# Altium project SMPS_12V&5V Out.PrjPCB
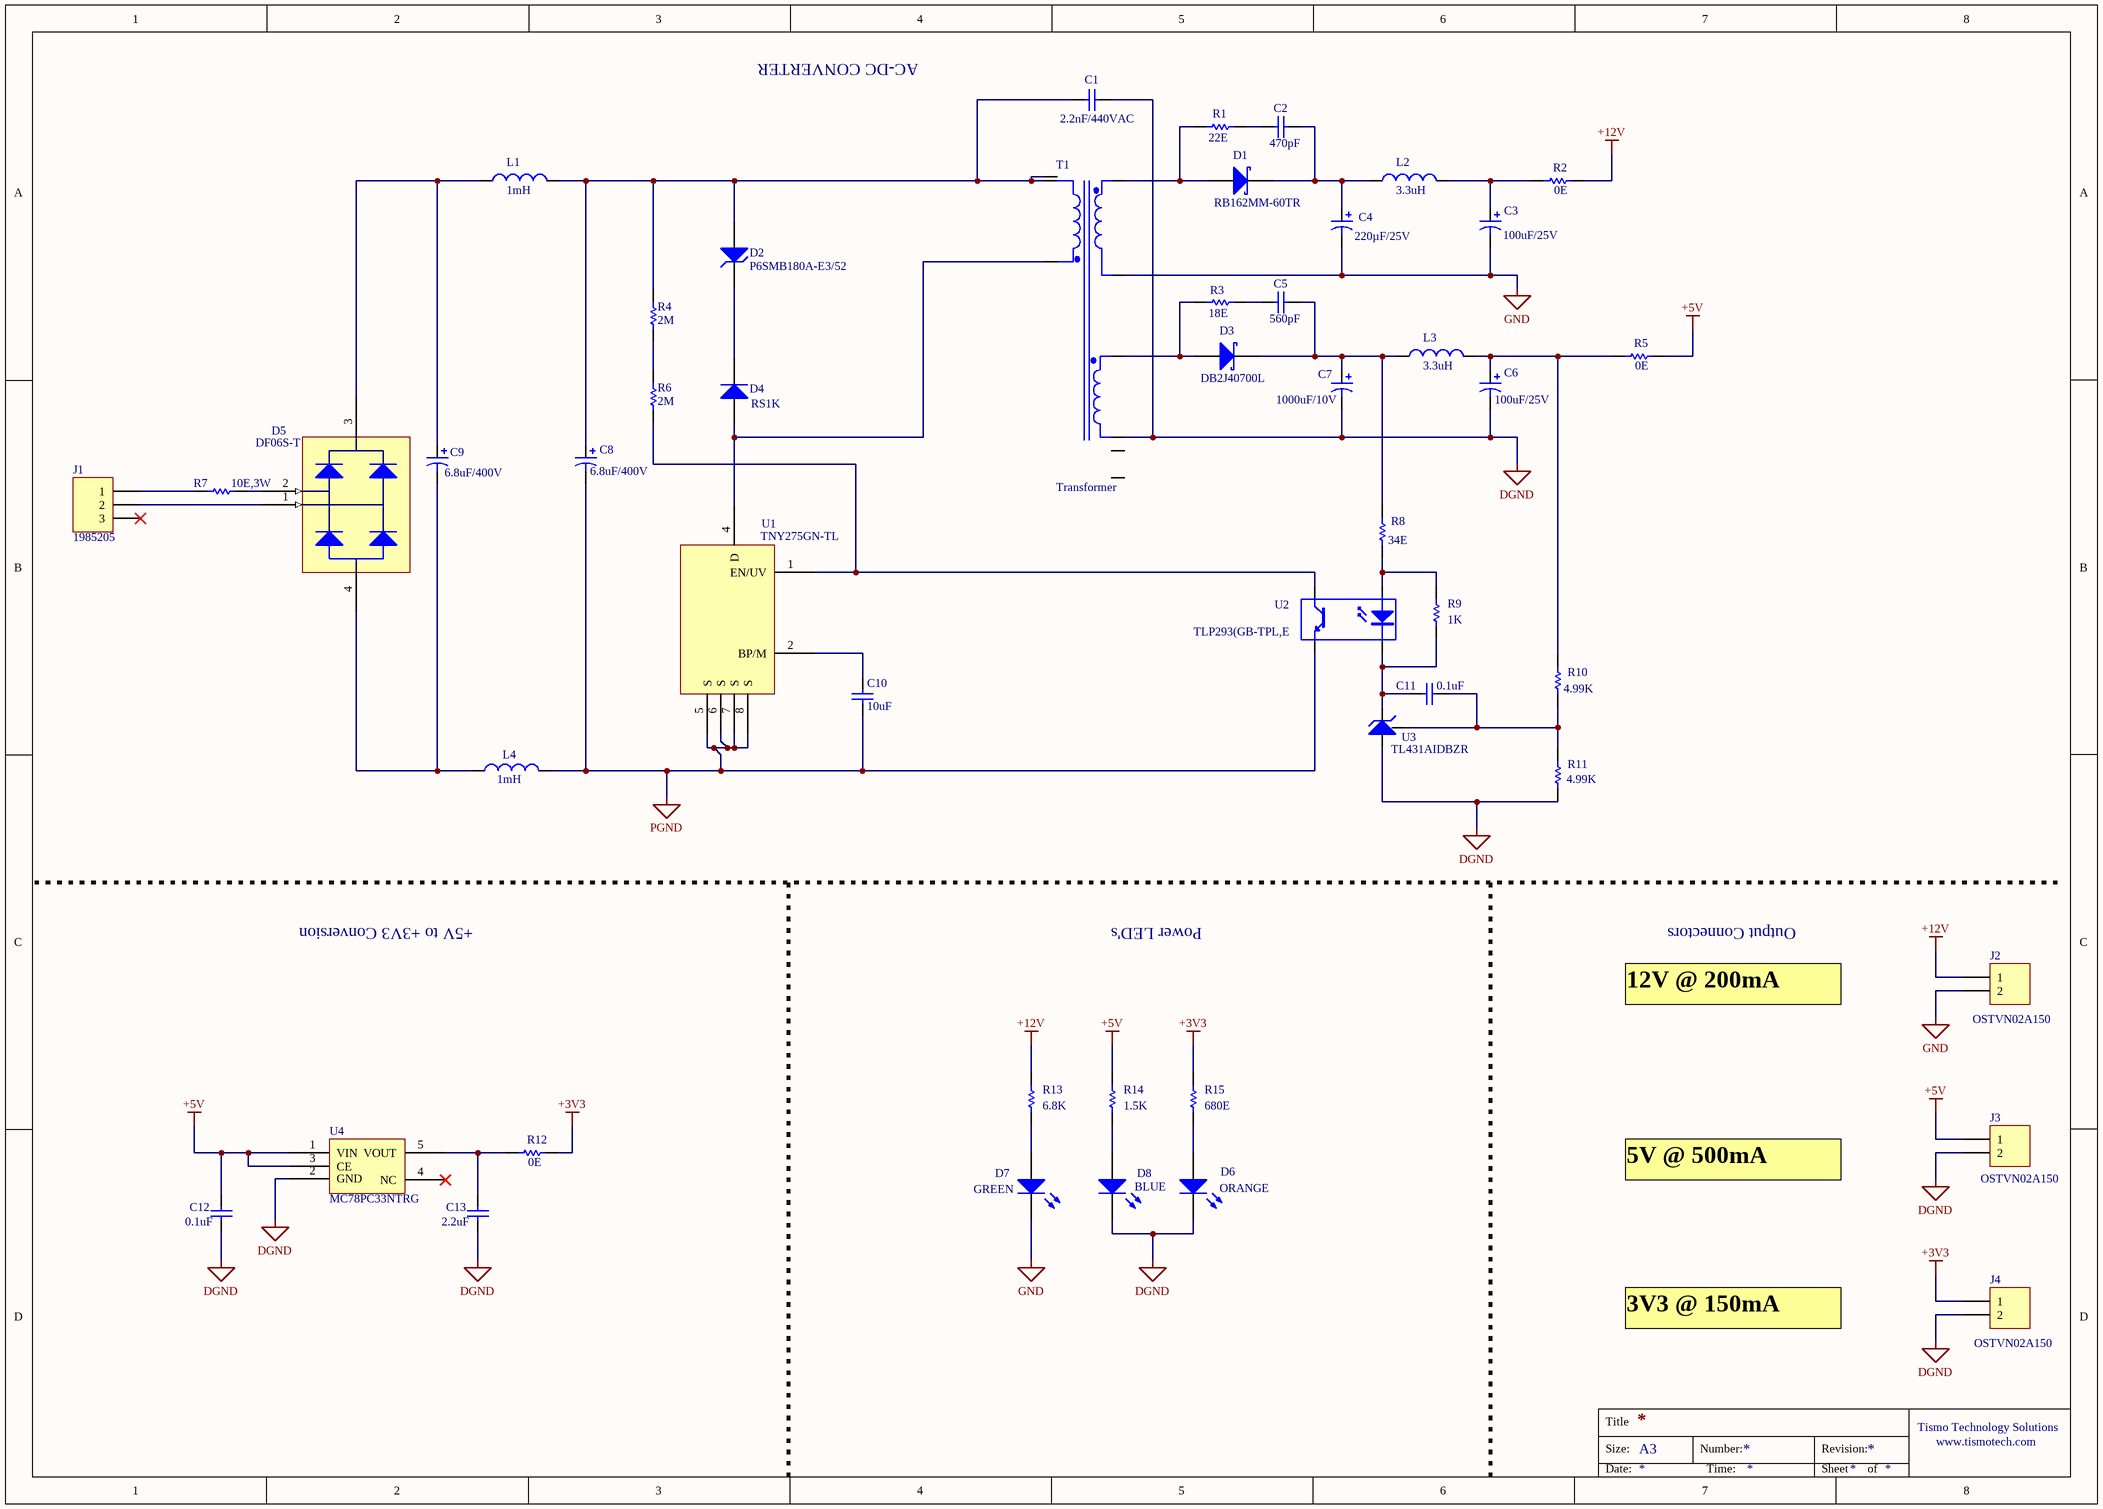
[diagram p0: SMPS.SchDoc]
1 sheet, 49 parts. Net scope: global (net labels, ports and power ports of the same name join across sheets).
Board file: SMPS.PcbDoc

## Sheet SMPS.SchDoc
size A3

### Parts
C1  2.2nF/440VAC  [2.2nF CAP]
C2  470pF  [C0603]
C3  100uF/25V  [CAP 6.3MM DIA]
C4  220µF/25V  [CAP 8 MM DIA]
C5  560pF  [C0603]
C6  100uF/25V  [CAP 6.3MM DIA]
C7  1000uF/10V  [CAP 10MM DIA]
C8  6.8uF/400V  [CAP 8 MM DIA]
C9  6.8uF/400V  [CAP 8 MM DIA]
C10  10uF  [R0805_2012]
C11  0.1uF  [R0805_2012]
C12  0.1uF  [R0805_2012]
C13  2.2uF  [R0805_2012]
D1  RB162MM-60TR  [GS-1_A]
D2  P6SMB180A-E3/52  [P6SMB]
D3  DB2J40700L  [SOD323]
D4  RS1K  [SMA]
D5  DF06S-T  [DF06S]
D6  ORANGE  [1.6X0.8X0.8]
D7  GREEN  [1.6X0.8X0.8]
D8  BLUE  [1.6X0.8X0.8]
J1  1985205  [AC SUPPLY CONNECTOR]
J2  OSTVN02A150  [OSTVN02A150]
J3  OSTVN02A150  [OSTVN02A150]
J4  OSTVN02A150  [OSTVN02A150]
L1  1mH  [SDR0805-102KL]
L2  3.3uH  [SDE0604A-120M]
L3  3.3uH  [SDE0604A-120M]
L4  1mH  [SDR0805-102KL]
R1  22E  [1206]
R2  0E  [R0603]
R3  18E  [1206]
R4  2M  [R1206 - Small pad]
R5  0E  [R0603]
R6  2M  [R1206 - Small pad]
R7  10E,3W  [FUSIBLE RESISTOR]
R8  34E  [R0603]
R9  1K  [R0603]
R10  4.99K  [R0603]
R11  4.99K  [R0603]
R12  0E  [R0603]
R13  6.8K  [R0603]
R14  1.5K  [R0603]
R15  680E  [R0603]
T1  Transformer  [Tra]
U1  TNY275GN-TL  [TNY284DG]
U2  TLP293(GB-TPL,E  [P25S01L]
U3  TL431AIDBZR  [SOT-23_M]
U4  MC78PC33NTRG  [SOT23-5_N]

### Nets
+3V3: J4.1 R12.2 R15.2
+5V: C12.1 J3.1 R5.2 R14.2 U4.1(VIN) U4.3(CE)
+12V: J2.1 R2.2 R13.2
DGND: C1.2 C6.2 C7.2 C12.2 C13.2 D6.2(K) D8.2(K) J3.2 J4.2 R11.1 T1.6 U3.3(A) U4.2(GND)
GND: C3.2 C4.2 D7.2(K) J2.2 T1.9
PGND: C8.2 C10.2 L4.2 U1.5(S) U1.6(S) U1.7(S) U1.8(S) U2.3(E)
NetC1_1: C1.1 C8.1 D2.1(A) L1.2 R4.2 T1.1 T1.2
NetC2_1: C2.1 R1.2
NetC2_2: C2.2 C4.1 D1.K L2.1
NetC3_1: C3.1 L2.2 R2.1
NetC5_1: C5.1 R3.2
NetC5_2: C5.2 C7.1 D3.K L3.1 R8.2
NetC6_1: C6.1 L3.2 R5.1 R10.2
NetC9_1: C9.1 D5.3 L1.1
NetC9_2: C9.2 D5.4 L4.1
NetC10_1: C10.1 U1.2(BP/M)
NetC11_1: C11.1 R10.1 R11.2 U3.1
NetC11_2: C11.2 R9.1 U2.2(K) U3.2(K)
NetC13_1: C13.1 R12.1 U4.5(VOUT)
NetD1_A: D1.A R1.1 T1.10
NetD2_2: D2.2(K) D4.2(K)
NetD3_A: D3.A R3.1 T1.7
NetD4_1: D4.1(A) T1.4 U1.4(D)
NetD5_1: D5.1 J1.2
NetD5_2: D5.2 R7.2
NetD6_1: D6.1(A) R15.1
NetD7_1: D7.1(A) R13.1
NetD8_1: D8.1(A) R14.1
NetJ1_1: J1.1 R7.1
NetR4_1: R4.1 R6.2
NetR6_1: R6.1 U1.1(EN/UV) U2.4(C)
NetR8_1: R8.1 R9.2 U2.1(A)

Not connected (* = marked no-connect by the designer): J1 3*; T1 3 5; U4 4(NC)*

### Notes on the sheet
- AC-DC CONVERTER
- +5V to +3V3 Conversion
- Power LED's
- Output Connectors
- 12V @ 200mA
- 5V @ 500mA
- 3V3 @ 150mA
- Title
- Size:
- A3
- Number:
- Revision:
- Tismo Technology Solutions
- www.tismotech.com
- Date:
- Time:
- Sheet
- of

### Library data of the parts
C1 = Cap: CAP CER 2200PF 440VAC Y5U RADIAL; Manufacturer: Vishay BC Components; Manufacturer Part Number: VY2222M35Y5US63V0; Tolerance: ±20%; Temperature Coefficient: Y5U (E); Ratings: X1, Y2; Supplier 1: Digi-Key; Supplier Part Number 1: BC2704-ND; RoHS: RoHS Compliant; Category: Capacitors; Stock 1: 19465; Pricing 1: 1=0.35, 10=0.24, 100=0.1358, 500=0.09584, 1000=0.08385, 2500=0.07986, 5000=0.07387 (USD); Packaging: Bulk; Part Status: Active; Voltage - Rated: 440VAC; Operating Temperature: -40°C ~ 125°C; Features: -; Applications: Safety; Failure Rate: -; Mounting Type: Through Hole; Package / Case: Radial, Disc; Size / Dimension: 0.354" Dia (9.00mm); Height - Seated (Max): 0.512" (13.00mm); Thickness (Max): -; Lead Spacing: 0.394" (10.00mm); Lead Style: Formed Leads - Kinked; ComponentLink1URL: http://www.vishay.com/docs/28535/vy2series.pdf; ComponentLink1Description: http://www.vishay.com/docs/28535/vy2series.pdf
C2 = Cap: CAP CER 470PF 100V C0G/NP0 0603; Manufacturer: Murata Electronics North America; Manufacturer Part Number: GCM1885C2A471JA16D; Tolerance: ±5%; Temperature Coefficient: C0G, NP0; Supplier 1: Digi-Key; Supplier Part Number 1: 490-4949-1-ND; RoHS: RoHS Compliant; Category: Capacitors; Stock 1: 40036; Pricing 1: 1=0.1, 10=0.076, 100=0.0341, 500=0.02434, 1000=0.01912 (USD); Packaging: Cut Tape (CT); Part Status: Active; Voltage - Rated: 100V; Operating Temperature: -55°C ~ 125°C; Features: -; Ratings: AEC-Q200; Applications: Automotive; Mounting Type: Surface Mount, MLCC; Package / Case: 0603 (1608 Metric); Size / Dimension: 0.063" L x 0.032" W (1.60mm x 0.80mm); Height - Seated (Max): -; Thickness (Max): 0.035" (0.90mm); Lead Spacing: -; Lead Style: -; ComponentLink1URL: http://www.murata.com/~/media/webrenewal/support/library/catalog/products/capacitor/mlcc/c03e.ashx; ComponentLink1Description: http://www.murata.com/~/media/webrenewal/support/library/catalog/products/capacitor/mlcc/c03e.ashx
C3 C6 = Cap Pol2: CAP ALUM 100UF 20% 25V RADIAL; Manufacturer: United Chemi-Con; Manufacturer Part Number: ELXZ250ELL101MFB5D; Capacitance: 100µF; Lifetime @ Temp.: 2000 Hrs @ 105°C; Polarization: Polar; Ripple Current: 116mA @ 120Hz; Impedance: 250 mOhm; Supplier 1: Digi-Key; Supplier Part Number 1: 565-1952-ND; RoHS: RoHS Compliant; Category: Capacitors; Stock 1: 4660; Pricing 1: 1=0.34, 10=0.235, 25=0.1928, 50=0.1646, 100=0.141, 250=0.11752, 500=0.10576, 1000=0.0893, 5000=0.0799 (USD); Packaging: Bulk; Part Status: Active; Tolerance: ±20%; Voltage Rating: 25V; ESR (Equivalent Series Resistance): -; Operating Temperature: -55°C ~ 105°C; Applications: Automotive; Lead Spacing: 0.098" (2.50mm); Size / Dimension: 0.248" Dia (6.30mm); Height - Seated (Max): 0.512" (13.00mm); Surface Mount Land Size: -; Mounting Type: Through Hole; Package / Case: Radial, Can; ComponentLink1URL: http://www.chemi-con.co.jp/cgi-bin/CAT_DB/SEARCH/cat_db_al.cgi?e=e&j=p&pdfname=lxz; ComponentLink1Description: http://www.chemi-con.co.jp/cgi-bin/CAT_DB/SEARCH/cat_db_al.cgi?e=e&j=p&pdfname=lxz
C4 = Cap Pol2: CAP ALUM 220UF 20% 25V RADIAL; Manufacturer: United Chemi-Con; Manufacturer Part Number: EKZE250ELL221MHB5D; Capacitance: 220µF; Lifetime @ Temp.: 3000 Hrs @ 105°C; Polarization: Polar; Ripple Current: 380mA @ 120Hz; Impedance: 72 mOhm; Supplier 1: Digi-Key; Supplier Part Number 1: 565-1674-ND; RoHS: RoHS Compliant; Category: Capacitors; Stock 1: 22214; Pricing 1: 1=0.44, 10=0.312, 25=0.266, 50=0.2356, 100=0.2052, 250=0.1748, 500=0.152, 1000=0.1292, 5000=0.114 (USD); Packaging: Bulk; Part Status: Active; Tolerance: ±20%; Voltage Rating: 25V; ESR (Equivalent Series Resistance): -; Operating Temperature: -40°C ~ 105°C; Applications: General Purpose; Lead Spacing: 0.138" (3.50mm); Size / Dimension: 0.315" Dia (8.00mm); Height - Seated (Max): 0.512" (13.00mm); Surface Mount Land Size: -; Mounting Type: Through Hole; Package / Case: Radial, Can; ComponentLink1URL: http://www.chemi-con.co.jp/cgi-bin/CAT_DB/SEARCH/cat_db_al.cgi?e=e&j=p&pdfname=kze; ComponentLink1Description: http://www.chemi-con.co.jp/cgi-bin/CAT_DB/SEARCH/cat_db_al.cgi?e=e&j=p&pdfname=kze
C5 = Cap: CAP CER 560PF 100V C0G/NP0 0603; Manufacturer: Murata Electronics North America; Manufacturer Part Number: GCM1885C2A561JA16D; Tolerance: ±5%; Temperature Coefficient: C0G, NP0; Supplier 1: Digi-Key; Supplier Part Number 1: 490-14764-1-ND; RoHS: RoHS Compliant; Category: Capacitors; Stock 1: 3690; Pricing 1: 1=0.21, 10=0.145, 100=0.0736, 500=0.05034, 1000=0.04453 (USD); Packaging: Cut Tape (CT); Part Status: Active; Voltage - Rated: 100V; Operating Temperature: -55°C ~ 125°C; Features: -; Ratings: AEC-Q200; Applications: Automotive; Failure Rate: -; Mounting Type: Surface Mount, MLCC; Package / Case: 0603 (1608 Metric); Size / Dimension: 0.063" L x 0.032" W (1.60mm x 0.80mm); Height - Seated (Max): -; Thickness (Max): 0.035" (0.90mm); Lead Spacing: -; Lead Style: -; ComponentLink1URL: http://search.murata.co.jp/Ceramy/image/img/A01X/G101/ENG/GCM1885C2A561JA16-01.pdf; ComponentLink1Description: http://search.murata.co.jp/Ceramy/image/img/A01X/G101/ENG/GCM1885C2A561JA16-01.pdf
C7 = Cap Pol2: CAP ALUM 1000UF 20% 10V RADIAL; Manufacturer: Wurth Electronics Inc.; Manufacturer Part Number: 860020275015; Lifetime @ Temp.: 2000 Hrs @ 105°C; Polarization: Polar; Ripple Current - Low Frequency: 520mA @ 120Hz; Ripple Current - High Frequency: 717.6mA @ 100kHz; Supplier 1: Digi-Key; Supplier Part Number 1: 732-8917-1-ND; RoHS: RoHS Compliant; Category: Capacitors; Stock 1: 1788; Pricing 1: 1=0.35, 50=0.295, 100=0.257, 250=0.228 (USD); Packaging: Cut Tape (CT); Part Status: Active; Tolerance: ±20%; ESR (Equivalent Series Resistance): -; Operating Temperature: -40°C ~ 105°C; Applications: General Purpose; Lead Spacing: 0.197" (5.00mm); Size / Dimension: 0.394" Dia (10.00mm); Height - Seated (Max): 0.551" (14.00mm); Surface Mount Land Size: -; Mounting Type: Through Hole; Package / Case: Radial, Can; ComponentLink1URL: http://katalog.we-online.de/pbs/datasheet/860020275015.pdf; ComponentLink1Description: http://katalog.we-online.de/pbs/datasheet/860020275015.pdf
C8 C9 = Cap Pol2: CAP ALUM 6.8UF 20% 400V RADIAL; Manufacturer: Wurth Electronics Inc.; Manufacturer Part Number: 860021374009; Lifetime @ Temp.: 2000 Hrs @ 105°C; Polarization: Polar; Ripple Current - Low Frequency: 75mA @ 120Hz; Ripple Current - High Frequency: 127.5mA @ 100kHz; Supplier 1: Digi-Key; Supplier Part Number 1: 732-8887-1-ND; RoHS: RoHS Compliant; Category: Capacitors; Stock 1: 800; Pricing 1: 1=0.5, 50=0.427, 100=0.372, 250=0.331 (USD); Packaging: Cut Tape (CT); Part Status: Active; Tolerance: ±20%; ESR (Equivalent Series Resistance): -; Operating Temperature: -25°C ~ 105°C; Applications: General Purpose; Lead Spacing: 0.138" (3.50mm); Size / Dimension: 0.315" Dia (8.00mm); Height - Seated (Max): 0.610" (15.50mm); Surface Mount Land Size: -; Mounting Type: Through Hole; Package / Case: Radial, Can; ComponentLink1URL: http://katalog.we-online.de/pbs/datasheet/860021374009.pdf; ComponentLink1Description: http://katalog.we-online.de/pbs/datasheet/860021374009.pdf
C10 = Cap: CAP CER 10UF 16V X7R 1206; Manufacturer: TDK Corporation; Manufacturer Part Number: C3216X7R1C106K160AC; Tolerance: ±10%; Supplier 1: Digi-Key; Supplier Part Number 1: 445-4042-1-ND; RoHS: RoHS Compliant; Category: Capacitors; Stock 1: 270274; Pricing 1: 1=0.32, 10=0.222, 100=0.126, 500=0.08896, 1000=0.07785 (USD); Packaging: Cut Tape (CT); Part Status: Active; Voltage - Rated: 16V; Temperature Coefficient: X7R; Operating Temperature: -55°C ~ 125°C; Features: Low ESL; Ratings: -; Applications: General Purpose; Failure Rate: -; Mounting Type: Surface Mount, MLCC; Package / Case: 1206 (3216 Metric); Size / Dimension: 0.126" L x 0.063" W (3.20mm x 1.60mm); Height - Seated (Max): -; Thickness (Max): 0.071" (1.80mm); Lead Spacing: -; Lead Style: -; ComponentLink1URL: https://product.tdk.com/info/en/catalog/datasheets/mlcc_commercial_general_en.pdf; ComponentLink1Description: https://product.tdk.com/info/en/catalog/datasheets/mlcc_commercial_general_en.pdf
C11 C12 = Cap: CAP CER 0.1UF 16V X7R 0402; Manufacturer: TDK Corporation; Manufacturer Part Number: C1005X7R1C104K050BC; Tolerance: ±10%; Supplier 1: Digi-Key; Supplier Part Number 1: 445-4952-1-ND; RoHS: RoHS Compliant; Category: Capacitors; Stock 1: 6348188; Pricing 1: 1=0.1, 10=0.058, 100=0.026, 500=0.0186, 1000=0.01461, 2500=0.01328, 5000=0.01222 (USD); Packaging: Cut Tape (CT); Part Status: Not For New Designs; Voltage - Rated: 16V; Temperature Coefficient: X7R; Operating Temperature: -55°C ~ 125°C; Features: Low ESL; Ratings: -; Applications: General Purpose; Failure Rate: -; Mounting Type: Surface Mount, MLCC; Package / Case: 0402 (1005 Metric); Size / Dimension: 0.039" L x 0.020" W (1.00mm x 0.50mm); Height - Seated (Max): -; Thickness (Max): 0.022" (0.55mm); Lead Spacing: -; Lead Style: -; ComponentLink1URL: https://product.tdk.com/info/en/catalog/datasheets/mlcc_commercial_general_en.pdf; ComponentLink1Description: https://product.tdk.com/info/en/catalog/datasheets/mlcc_commercial_general_en.pdf
C13 = Cap: CAP CER 2.2UF 50V X5R 0603; Manufacturer: Murata Electronics North America; Manufacturer Part Number: GRM188R61H225KE11D; Tolerance: ±10%; Supplier 1: Digi-Key; Supplier Part Number 1: 490-10733-1-ND; RoHS: RoHS Compliant; Category: Capacitors; Stock 1: 160459; Pricing 1: 1=0.29, 10=0.199, 100=0.1127, 500=0.07954, 1000=0.0696 (USD); Packaging: Cut Tape (CT); Part Status: Active; Voltage - Rated: 50V; Temperature Coefficient: X5R; Operating Temperature: -55°C ~ 85°C; Features: -; Ratings: -; Applications: General Purpose; Mounting Type: Surface Mount, MLCC; Package / Case: 0603 (1608 Metric); Size / Dimension: 0.063" L x 0.032" W (1.60mm x 0.80mm); Height - Seated (Max): -; Thickness (Max): 0.039" (1.00mm); Lead Spacing: -; Lead Style: -; ComponentLink1URL: http://search.murata.co.jp/Ceramy/image/img/A01X/G101/ENG/GRM188R61H225KE11-01.pdf; ComponentLink1Description: http://search.murata.co.jp/Ceramy/image/img/A01X/G101/ENG/GRM188R61H225KE11-01.pdf
D1 = Diode BAT17: DIODE SCHOTTKY 60V 1A PMDU; Manufacturer: Rohm Semiconductor; Voltage - Forward (Vf) (Max) @ If: 650mV @ 1A; Speed: Fast Recovery =< 500ns, > 200mA (Io); Current - Reverse Leakage @ Vr: 100µA @ 60V; Supplier 1: Digi-Key; Supplier Part Number 1: RB162MM-60CT-ND; Manufacturer Part Number: RB162MM-60TR; RoHS: RoHS Compliant; Category: Discrete Semiconductor Products; Stock 1: 11254; Pricing 1: 1=0.39, 10=0.351, 25=0.2532, 100=0.1968, 250=0.12372, 500=0.10544, 1000=0.0717 (USD); Packaging: Cut Tape (CT); Part Status: Active; Diode Type: Schottky; Voltage - DC Reverse (Vr) (Max): 60V; Current - Average Rectified (Io): 1A; Reverse Recovery Time (trr): -; Capacitance @ Vr, F: -; Mounting Type: Surface Mount; Package / Case: SOD-123F; Supplier Device Package: PMDU; Operating Temperature - Junction: 150°C (Max); ComponentLink1URL: http://rohmfs.rohm.com/en/products/databook/datasheet/discrete/diode/schottky_barrier/rb162mm-60.pdf; ComponentLink1Description: http://rohmfs.rohm.com/en/products/databook/datasheet/discrete/diode/schottky_barrier/rb162mm-60.pdf
D2 = D Zener: TVS DIODE 154VWM 246VC SMB; Manufacturer: Vishay Semiconductor Diodes Division; Type: Zener; Unidirectional Channels: 1; Voltage - Reverse Standoff (Typ): 154V; Voltage - Breakdown (Min): 171V; Voltage - Clamping (Max) @ Ipp: 246V; Current - Peak Pulse (10/1000µs): 2.4A; Power - Peak Pulse: 600W; Power Line Protection: No; Supplier 1: Digi-Key; Supplier Part Number 1: P6SMB180A-E3/52GICT-ND; Manufacturer Part Number: P6SMB180A-E3/52; RoHS: RoHS Compliant; Category: Circuit Protection; Stock 1: 2770; Pricing 1: 1=0.46, 10=0.346, 25=0.3116, 100=0.2153, 250=0.18128 (USD); Packaging: Cut Tape (CT); Part Status: Active; Bidirectional Channels: -; Applications: General Purpose; Capacitance @ Frequency: -; Operating Temperature: -65°C ~ 150°C (TJ); Mounting Type: Surface Mount; Package / Case: DO-214AA, SMB; Supplier Device Package: DO-214AA (SMBJ); ComponentLink1URL: http://www.vishay.com/docs/88370/p6smb.pdf; ComponentLink1Description: http://www.vishay.com/docs/88370/p6smb.pdf
D3 = Diode BAT17: DIODE SCHOTTKY 40V 500MA SMINI2; Manufacturer: Panasonic Electronic Components; Voltage - Forward (Vf) (Max) @ If: 550mV @ 500mA; Speed: Fast Recovery =< 500ns, > 200mA (Io); Reverse Recovery Time (trr): 3.6ns; Current - Reverse Leakage @ Vr: 100µA @ 35V; Capacitance @ Vr, F: 10.5pF @ 10V, 1MHz; Supplier 1: Digi-Key; Supplier Part Number 1: DB2J40700LCT-ND; Manufacturer Part Number: DB2J40700L; RoHS: RoHS Compliant; Category: Discrete Semiconductor Products; Stock 1: 65907; Pricing 1: 1=0.44, 10=0.313, 25=0.2436, 100=0.1846, 250=0.1306, 500=0.10448, 1000=0.08011 (USD); Packaging: Cut Tape (CT); Part Status: Active; Diode Type: Schottky; Voltage - DC Reverse (Vr) (Max): 40V; Current - Average Rectified (Io): 500mA; Mounting Type: Surface Mount; Package / Case: SC-90, SOD-323F; Supplier Device Package: SMini2-F5-B; Operating Temperature - Junction: 125°C (Max); ComponentLink1URL: http://www.semicon.panasonic.co.jp/ds4/DB2J407_E.pdf; ComponentLink1Description: http://www.semicon.panasonic.co.jp/ds4/DB2J407_E.pdf
D4 = Diode: DIODE GEN PURP 800V 1A SMA; Manufacturer: Fairchild Semiconductor; Diode Type: Standard; Voltage - Forward (Vf) (Max) @ If: 1.3V @ 1A; Speed: Fast Recovery =< 500ns, > 200mA (Io); Reverse Recovery Time (trr): 500ns; Current - Reverse Leakage @ Vr: 5µA @ 800V; Capacitance @ Vr, F: 10pF @ 4V, 1MHz; Supplier 1: Digi-Key; Supplier Part Number 1: RS1KFSCT-ND; Manufacturer Part Number: RS1K; RoHS: RoHS Compliant; Category: Discrete Semiconductor Products; Stock 1: 4801; Pricing 1: 1=0.35, 10=0.264, 100=0.1491, 500=0.09888, 1000=0.07584 (USD); Packaging: Cut Tape (CT); Part Status: Active; Voltage - DC Reverse (Vr) (Max): 800V; Current - Average Rectified (Io): 1A; Mounting Type: Surface Mount; Package / Case: DO-214AC, SMA; Supplier Device Package: SMA (DO-214AC); Operating Temperature - Junction: -55°C ~ 150°C; ComponentLink1URL: http://www.fairchildsemi.com/datasheets/RS/RS1A.pdf; ComponentLink1Description: http://www.fairchildsemi.com/datasheets/RS/RS1A.pdf
D5 = BRIDGE RECTIFIER: RECT BRIDGE GPP 1A 600V DFS; Manufacturer: Diodes Incorporated; Diode Type: Single Phase; Supplier 1: Digi-Key; Supplier Part Number 1: DF06S-TDICT-ND; Manufacturer Part Number: DF06S-T; RoHS: RoHS Compliant; Category: Discrete Semiconductor Products; Stock 1: 67854; Pricing 1: 1=0.4, 10=0.345, 100=0.2573, 500=0.20216 (USD); Packaging: Cut Tape (CT); Part Status: Active; Voltage - Peak Reverse (Max): 600V; Current - DC Forward (If) (Max): 1A; Mounting Type: Surface Mount; Package / Case: 4-SMD, Gull Wing; Operating Temperature: -65°C ~ 150°C (TJ); Supplier Device Package: DF-S; ComponentLink1URL: http://www.diodes.com/_files/datasheets/ds17001.pdf; ComponentLink1Description: http://www.diodes.com/_files/datasheets/ds17001.pdf
D6 = LED0: LED ORANGE CLEAR 0603 SMD; Manufacturer: Lite-On Inc.; Manufacturer Part Number: LTST-C190KFKT; Lens Color: Colorless; Millicandela Rating: 90mcd; Lens Style/Size: Rectangle with Flat Top, 1.10mm x 0.80mm; Voltage - Forward (Vf) (Typ): 2V; Current - Test: 20mA; Viewing Angle: 130°; Wavelength - Dominant: 605nm; Wavelength - Peak: 611nm; Supplier 1: Digi-Key; Supplier Part Number 1: 160-1434-1-ND; RoHS: RoHS Compliant; Category: Optoelectronics; Stock 1: 61725; Pricing 1: 1=0.25, 10=0.183, 25=0.1348, 100=0.0963, 250=0.06544, 500=0.05776, 1000=0.04524 (USD); Packaging: Cut Tape (CT); Part Status: Active; Color: Orange; Lens Transparency: Clear; Mounting Type: Surface Mount; Features: -; Package / Case: 0603 (1608 Metric); Size / Dimension: 1.60mm L x 0.80mm W; Height (Max): 0.80mm; ComponentLink1URL: http://optoelectronics.liteon.com/upload/download/DS-22-99-0186/LTST-C190KFKT.PDF; ComponentLink1Description: http://optoelectronics.liteon.com/upload/download/DS-22-99-0186/LTST-C190KFKT.PDF
D7 = LED0: LED GREEN CLEAR 0603 SMD; Manufacturer: Lite-On Inc.; Manufacturer Part Number: LTST-C190KGKT; Lens Color: Colorless; Millicandela Rating: 35mcd; Lens Style/Size: Rectangle with Flat Top, 1.10mm x 0.80mm; Voltage - Forward (Vf) (Typ): 2V; Current - Test: 20mA; Viewing Angle: 130°; Wavelength - Dominant: 571nm; Wavelength - Peak: 574nm; Supplier 1: Digi-Key; Supplier Part Number 1: 160-1435-1-ND; RoHS: RoHS Compliant; Category: Optoelectronics; Stock 1: 1112499; Pricing 1: 1=0.27, 10=0.196, 25=0.1448, 100=0.1034, 250=0.07032, 500=0.06204, 1000=0.0486 (USD); Packaging: Cut Tape (CT); Part Status: Active; Color: Green; Lens Transparency: Clear; Mounting Type: Surface Mount; Features: -; Package / Case: 0603 (1608 Metric); Size / Dimension: 1.60mm L x 0.80mm W; Height (Max): 0.80mm; ComponentLink1URL: http://optoelectronics.liteon.com/upload/download/DS22-2000-074/LTST-C190KGKT.PDF; ComponentLink1Description: http://optoelectronics.liteon.com/upload/download/DS22-2000-074/LTST-C190KGKT.PDF
D8 = LED0: LED BLUE CLEAR 0603 SMD; Manufacturer: Lite-On Inc.; Manufacturer Part Number: LTST-C193TBKT-5A; Lens Color: Colorless; Millicandela Rating: 15mcd; Lens Style/Size: Rectangle with Flat Top, 1.15mm x 0.80mm; Voltage - Forward (Vf) (Typ): 2.8V; Current - Test: 5mA; Viewing Angle: 130°; Wavelength - Dominant: 470nm; Wavelength - Peak: 468nm; Supplier 1: Digi-Key; Supplier Part Number 1: 160-1827-1-ND; RoHS: RoHS Compliant; Category: Optoelectronics; Stock 1: 401331; Pricing 1: 1=0.47, 10=0.336, 25=0.2572, 100=0.1678, 250=0.12304, 500=0.10442, 1000=0.08577 (USD); Packaging: Cut Tape (CT); Part Status: Active; Color: Blue; Lens Transparency: Clear; Mounting Type: Surface Mount; Features: -; Package / Case: 0603 (1608 Metric); Supplier Device Package: Chip LED; Size / Dimension: 1.60mm L x 0.80mm W; Height (Max): 0.45mm; ComponentLink1URL: http://media.digikey.com/pdf/Data%20Sheets/Lite-On%20PDFs/LTST-C193TBKT-5A.pdf; ComponentLink1Description: http://media.digikey.com/pdf/Data%20Sheets/Lite-On%20PDFs/LTST-C193TBKT-5A.pdf
J1 = Header 3: TERM BLOCK PCB 3POS 3.5MM GREEN; Manufacturer: Phoenix Contact; Positions Per Level: 3; Pitch: 0.138" (3.50mm); Mating Orientation: 45° (135°) Angle with Board; Wire Gauge: 16-24 AWG; Wire Termination: Screwless - Spring Cage, Tension Clamp; Supplier 1: Digi-Key; Supplier Part Number 1: 277-1623-ND; Manufacturer Part Number: 1985205; RoHS: RoHS Compliant; Category: Connectors, Interconnects; Stock 1: 11724; Pricing 1: 1=0.38, 10=0.368, 50=0.352, 100=0.3424, 250=0.32, 500=0.2944, 1000=0.272 (USD); Packaging: Bulk; Part Status: Active; Mounting Type: Through Hole; Features: -; Color: Green; Operating Temperature: -; Housing Material: Polyamide (PA), Nylon; Contact Material - Plating: -; Clamp Material - Plating: -; Screw Material - Plating: -; Torque - Screw: -; Screw Thread: -; ComponentLink1URL: http://media.digikey.com/pdf/Data%20Sheets/Phoenix%20Contact%20PDFs/COMBICON%20Spring-Cage%20PCB%20Term.%20Blocks.pdf; ComponentLink1Description: http://media.digikey.com/pdf/Data%20Sheets/Phoenix%20Contact%20PDFs/COMBICON%20Spring-Cage%20PCB%20Term.%20Blocks.pdf
J2-J4 = Header 2: CONN TERM BLOCK 2.54MM 2POS PCB; Manufacturer: On Shore Technology Inc.; Positions Per Level: 2; Pitch: 0.100" (2.54mm); Mating Orientation: Horizontal with Board; Wire Gauge: 20-30 AWG; Wire Termination: Screw - Rising Cage Clamp; Clamp Material - Plating: Brass; Screw Material - Plating: Steel - Zinc Plated; Torque - Screw: 0.15 Nm (1.3 Lb-In); Screw Thread: M1.6; Supplier 1: Digi-Key; Supplier Part Number 1: ED10561-ND; Manufacturer Part Number: OSTVN02A150; RoHS: RoHS Compliant; Category: Connectors, Interconnects; Stock 1: 26890; Pricing 1: 1=0.91, 10=0.568, 25=0.486, 50=0.4368, 100=0.4277, 250=0.364, 500=0.3458, 1000=0.3094, 5000=0.24206 (USD); Packaging: Bulk; Part Status: Active; Mounting Type: Through Hole; Features: -; Color: Green; Operating Temperature: -30°C ~ 105°C; Housing Material: Thermoplastic; Contact Material - Plating: Brass; ComponentLink1URL: http://www.on-shore.com/wp-content/uploads/2015/09/ostvnxxa150.pdf; ComponentLink1Description: http://www.on-shore.com/wp-content/uploads/2015/09/ostvnxxa150.pdf
L1 L4 = Inductor: FIXED IND 1MH 210MA 4.5 OHM SMD; Manufacturer: Bourns Inc.; Type: Wirewound; Material - Core: Ferrite; Tolerance: ±10%; Current - Saturation: 340mA; Shielding: Unshielded; DC Resistance (DCR): 4.5 Ohm Max; Q @ Freq: 27 @ 252kHz; Frequency - Self Resonant: 3MHz; Frequency - Test: 1kHz; Supplier 1: Digi-Key; Supplier Part Number 1: SDR0805-102KLCT-ND; Manufacturer Part Number: SDR0805-102KL; RoHS: RoHS Compliant; Category: Inductors, Coils, Chokes; Stock 1: 5025; Pricing 1: 1=0.57, 10=0.502, 25=0.466, 50=0.3942, 100=0.3584, 250=0.33688, 500=0.30106 (USD); Packaging: Cut Tape (CT); Part Status: Active; Inductance: 1mH; Current Rating: 210mA; Ratings: -; Operating Temperature: -40°C ~ 125°C; Mounting Type: Surface Mount; Package / Case: Nonstandard; Supplier Device Package: -; Size / Dimension: 0.307" L x 0.307" W (7.80mm x 7.80mm); Height - Seated (Max): 0.209" (5.30mm); ComponentLink1URL: http://www.bourns.com/docs/Product-Datasheets/SDR0805.pdf; ComponentLink1Description: http://www.bourns.com/docs/Product-Datasheets/SDR0805.pdf
L2 L3 = Inductor: FIXED IND 3.3UH 3.8A 60 MOHM SMD; Manufacturer: Bourns Inc.; Manufacturer Part Number: SDE0604A-3R3M; Type: Wirewound; Material - Core: Ferrite; Tolerance: ±20%; Shielding: Unshielded; DC Resistance (DCR): 60 mOhm Max; Supplier 1: Digi-Key; Supplier Part Number 1: SDE0604A-3R3MCT-ND; RoHS: RoHS Compliant; Category: Inductors, Coils, Chokes; Stock 1: 13; Pricing 1: 1=0.55, 10=0.479, 100=0.3421, 500=0.28738 (USD); Packaging: Cut Tape (CT); Part Status: Active; Q @ Freq: -; Ratings: AEC-Q200; Operating Temperature: -40°C ~ 125°C; Mounting Type: Surface Mount; Package / Case: Nonstandard; Supplier Device Package: -; Size / Dimension: 0.228" L x 0.205" W (5.80mm x 5.20mm); Height - Seated (Max): 0.189" (4.80mm); ComponentLink1URL: http://www.bourns.com/docs/Product-Datasheets/SDE0604A.pdf; ComponentLink1Description: http://www.bourns.com/docs/Product-Datasheets/SDE0604A.pdf
R1 = Res1: RES SMD 22 OHM 5% 1/4W 1206; Manufacturer: Panasonic Electronic Components; Manufacturer Part Number: ERJ-8GEYJ220V; Power (Watts): 0.25W, 1/4W; Temperature Coefficient: ±200ppm/°C; Supplier 1: Digi-Key; Supplier Part Number 1: P22ECT-ND; RoHS: RoHS Compliant; Category: Resistors; Stock 1: 56561; Pricing 1: 1=0.1, 10=0.039, 100=0.016, 1000=0.00719, 2500=0.00624 (USD); Packaging: Cut Tape (CT); Part Status: Active; Tolerance: ±5%; Composition: Thick Film; Features: Automotive AEC-Q200; Operating Temperature: -55°C ~ 155°C; Package / Case: 1206 (3216 Metric); Supplier Device Package: 1206; Size / Dimension: 0.126" L x 0.063" W (3.20mm x 1.60mm); Height - Seated (Max): 0.028" (0.70mm); Failure Rate: -; ComponentLink1URL: http://industrial.panasonic.com/www-cgi/jvcr13pz.cgi?E+PZ+3+AOA0001+ERJ8GEYJ220V+7+WW; ComponentLink1Description: http://industrial.panasonic.com/www-cgi/jvcr13pz.cgi?E+PZ+3+AOA0001+ERJ8GEYJ220V+7+WW
R2 R5 R12 = Res1: RES SMD 0.0OHM JUMPER 1/10W 0603; Manufacturer: Yageo; Manufacturer Part Number: RC0603JR-070RL; Resistance (Ohms): 0.0; Power (Watts): 0.1W, 1/10W; Supplier 1: Digi-Key; Supplier Part Number 1: 311-0.0GRCT-ND; RoHS: RoHS Compliant; Category: Resistors; Stock 1: 4691047; Pricing 1: 1=0.1, 10=0.011, 25=0.008, 100=0.0045, 250=0.00348, 500=0.00278, 1000=0.00204, 2500=0.00177 (USD); Packaging: Cut Tape (CT); Tolerance: Jumper; Composition: Thick Film; Features: Moisture Resistant; Temperature Coefficient: -; Operating Temperature: -55°C ~ 155°C; Package / Case: 0603 (1608 Metric); Supplier Device Package: 0603; Size / Dimension: 0.063" L x 0.031" W (1.60mm x 0.80mm); Height: 0.022" (0.55mm); Number of Terminations: 2; ComponentLink1URL: http://www.yageo.com/documents/recent/PYu-RC_Group_51_RoHS_L_04.pdf; ComponentLink1Description: http://www.yageo.com/documents/recent/PYu-RC_Group_51_RoHS_L_04.pdf
R3 = Res1: RES SMD 18 OHM 1% 1/4W 1206; Manufacturer: Panasonic Electronic Components; Manufacturer Part Number: ERJ-8ENF18R0V; Power (Watts): 0.25W, 1/4W; Temperature Coefficient: ±100ppm/°C; Supplier 1: Digi-Key; Supplier Part Number 1: P18.0FCT-ND; RoHS: RoHS Compliant; Category: Resistors; Stock 1: 3209; Pricing 1: 1=0.1, 10=0.052, 100=0.0213, 1000=0.00958, 2500=0.00832 (USD); Packaging: Cut Tape (CT); Part Status: Active; Tolerance: ±1%; Composition: Thick Film; Features: Automotive AEC-Q200; Operating Temperature: -55°C ~ 155°C; Package / Case: 1206 (3216 Metric); Supplier Device Package: 1206; Size / Dimension: 0.126" L x 0.063" W (3.20mm x 1.60mm); Height - Seated (Max): 0.028" (0.70mm); Failure Rate: -; ComponentLink1URL: https://industrial.panasonic.com/cdbs/www-data/pdf/RDA0000/AOA0000C304.pdf; ComponentLink1Description: https://industrial.panasonic.com/cdbs/www-data/pdf/RDA0000/AOA0000C304.pdf
R4 R6 = Res1: RES SMD 2M OHM 5% 1/4W 1206; Manufacturer: Yageo; Manufacturer Part Number: RC1206JR-072ML; Power (Watts): 0.25W, 1/4W; Temperature Coefficient: ±100ppm/°C; Supplier 1: Digi-Key; Supplier Part Number 1: 311-2.0MERCT-ND; RoHS: RoHS Compliant; Category: Resistors; Stock 1: 70355; Pricing 1: 1=0.1, 10=0.025, 100=0.0103, 1000=0.00463, 2500=0.00402 (USD); Packaging: Cut Tape (CT); Part Status: Active; Tolerance: ±5%; Composition: Thick Film; Features: Moisture Resistant; Operating Temperature: -55°C ~ 155°C; Package / Case: 1206 (3216 Metric); Supplier Device Package: 1206; Size / Dimension: 0.122" L x 0.063" W (3.10mm x 1.60mm); Height - Seated (Max): 0.026" (0.65mm); Failure Rate: -; ComponentLink1URL: http://www.yageo.com/documents/recent/PYu-RC_Group_51_RoHS_L_7.pdf; ComponentLink1Description: http://www.yageo.com/documents/recent/PYu-RC_Group_51_RoHS_L_7.pdf
R7 = Res1: RES 10 OHM 3W 5% AXIAL; Manufacturer: Yageo; Manufacturer Part Number: FKN3WSJT-73-10R; Resistance (Ohms): 10; Supplier 1: Digi-Key; Supplier Part Number 1: YAG1228CT-ND; RoHS: RoHS Compliant; Category: Resistors; Stock 1: 7875; Pricing 1: 1=0.4, 10=0.304, 25=0.2312, 50=0.1718, 100=0.1278, 250=0.10796, 500=0.09254 (USD); Packaging: Cut Tape (CT); Part Status: Active; Tolerance: ±5%; Power (Watts): 3W; Composition: Wirewound; Features: Flame Proof, Fusible, Safety; Temperature Coefficient: -; Operating Temperature: -40°C ~ 155°C; Package / Case: Axial; Supplier Device Package: Axial; Size / Dimension: 0.197" Dia x 0.610" L (5.00mm x 15.50mm); Height - Seated (Max): -; Failure Rate: -; ComponentLink1URL: http://www.yageo.com/documents/recent/Yageo%20LR_FKN_2013.pdf; ComponentLink1Description: http://www.yageo.com/documents/recent/Yageo%20LR_FKN_2013.pdf
R8 = Res1: RES SMD 34 OHM 1% 1/10W 0603; Manufacturer: Yageo; Manufacturer Part Number: RC0603FR-0734RL; Power (Watts): 0.1W, 1/10W; Temperature Coefficient: ±100ppm/°C; Supplier 1: Digi-Key; Supplier Part Number 1: 311-34.0HRCT-ND; RoHS: RoHS Compliant; Category: Resistors; Stock 1: 91114; Pricing 1: 1=0.1, 10=0.015, 100=0.006, 1000=0.00268, 2500=0.00233 (USD); Packaging: Cut Tape (CT); Part Status: Active; Tolerance: ±1%; Composition: Thick Film; Features: Moisture Resistant; Operating Temperature: -55°C ~ 155°C; Package / Case: 0603 (1608 Metric); Supplier Device Package: 0603; Size / Dimension: 0.063" L x 0.032" W (1.60mm x 0.80mm); Height - Seated (Max): 0.022" (0.55mm); Failure Rate: -; ComponentLink1URL: http://www.yageo.com/documents/recent/PYu-RC_Group_51_RoHS_L_7.pdf; ComponentLink1Description: http://www.yageo.com/documents/recent/PYu-RC_Group_51_RoHS_L_7.pdf
R9 = Res1: RES SMD 1K OHM 1% 1/10W 0603; Manufacturer: Yageo; Manufacturer Part Number: RC0603FR-071KL; Power (Watts): 0.1W, 1/10W; Temperature Coefficient: ±100ppm/°C; Supplier 1: Digi-Key; Supplier Part Number 1: 311-1.00KHRCT-ND; RoHS: RoHS Compliant; Category: Resistors; Stock 1: 11896285; Pricing 1: 1=0.1, 10=0.015, 100=0.006, 1000=0.00268, 2500=0.00233 (USD); Packaging: Cut Tape (CT); Part Status: Active; Tolerance: ±1%; Composition: Thick Film; Features: Moisture Resistant; Operating Temperature: -55°C ~ 155°C; Package / Case: 0603 (1608 Metric); Supplier Device Package: 0603; Size / Dimension: 0.063" L x 0.032" W (1.60mm x 0.80mm); Height - Seated (Max): 0.022" (0.55mm); Failure Rate: -; ComponentLink1URL: http://www.yageo.com/documents/recent/PYu-RC_Group_51_RoHS_L_7.pdf; ComponentLink1Description: http://www.yageo.com/documents/recent/PYu-RC_Group_51_RoHS_L_7.pdf
R10 R11 = Res1: RES SMD 4.99K OHM 1% 1/10W 0603; Manufacturer: Yageo; Manufacturer Part Number: RC0603FR-074K99L; Power (Watts): 0.1W, 1/10W; Temperature Coefficient: ±100ppm/°C; Supplier 1: Digi-Key; Supplier Part Number 1: 311-4.99KHRCT-ND; RoHS: RoHS Compliant; Category: Resistors; Stock 1: 2717891; Pricing 1: 1=0.1, 10=0.015, 100=0.006, 1000=0.00268, 2500=0.00233 (USD); Packaging: Cut Tape (CT); Part Status: Active; Tolerance: ±1%; Composition: Thick Film; Features: Moisture Resistant; Operating Temperature: -55°C ~ 155°C; Package / Case: 0603 (1608 Metric); Supplier Device Package: 0603; Size / Dimension: 0.063" L x 0.032" W (1.60mm x 0.80mm); Height - Seated (Max): 0.022" (0.55mm); Failure Rate: -; ComponentLink1URL: http://www.yageo.com/documents/recent/PYu-RC_Group_51_RoHS_L_7.pdf; ComponentLink1Description: http://www.yageo.com/documents/recent/PYu-RC_Group_51_RoHS_L_7.pdf
R13 = Res1: RES SMD 6.8K OHM 5% 1/10W 0603; Manufacturer: Yageo; Manufacturer Part Number: RC0603JR-076K8L; Power (Watts): 0.1W, 1/10W; Temperature Coefficient: ±100ppm/°C; Supplier 1: Digi-Key; Supplier Part Number 1: 311-6.8KGRCT-ND; RoHS: RoHS Compliant; Category: Resistors; Stock 1: 493929; Pricing 1: 1=0.1, 10=0.011, 100=0.0046, 1000=0.00207, 2500=0.0018 (USD); Packaging: Cut Tape (CT); Part Status: Active; Tolerance: ±5%; Composition: Thick Film; Features: Moisture Resistant; Operating Temperature: -55°C ~ 155°C; Package / Case: 0603 (1608 Metric); Supplier Device Package: 0603; Size / Dimension: 0.063" L x 0.032" W (1.60mm x 0.80mm); Height - Seated (Max): 0.022" (0.55mm); Failure Rate: -; ComponentLink1URL: http://www.yageo.com/documents/recent/PYu-RC_Group_51_RoHS_L_7.pdf; ComponentLink1Description: http://www.yageo.com/documents/recent/PYu-RC_Group_51_RoHS_L_7.pdf
R14 = Res1: RES SMD 1.5K OHM 5% 1/10W 0603; Manufacturer: Yageo; Manufacturer Part Number: RC0603JR-071K5L; Power (Watts): 0.1W, 1/10W; Temperature Coefficient: ±100ppm/°C; Supplier 1: Digi-Key; Supplier Part Number 1: 311-1.5KGRCT-ND; RoHS: RoHS Compliant; Category: Resistors; Stock 1: 695773; Pricing 1: 1=0.1, 10=0.011, 100=0.0046, 1000=0.00207, 2500=0.0018 (USD); Packaging: Cut Tape (CT); Part Status: Active; Tolerance: ±5%; Composition: Thick Film; Features: Moisture Resistant; Operating Temperature: -55°C ~ 155°C; Package / Case: 0603 (1608 Metric); Supplier Device Package: 0603; Size / Dimension: 0.063" L x 0.032" W (1.60mm x 0.80mm); Height - Seated (Max): 0.022" (0.55mm); Failure Rate: -; ComponentLink1URL: http://www.yageo.com/documents/recent/PYu-RC_Group_51_RoHS_L_7.pdf; ComponentLink1Description: http://www.yageo.com/documents/recent/PYu-RC_Group_51_RoHS_L_7.pdf
R15 = Res1: RES SMD 680 OHM 5% 1/10W 0603; Manufacturer: Yageo; Manufacturer Part Number: RC0603JR-07680RL; Power (Watts): 0.1W, 1/10W; Temperature Coefficient: ±100ppm/°C; Supplier 1: Digi-Key; Supplier Part Number 1: 311-680GRCT-ND; RoHS: RoHS Compliant; Category: Resistors; Stock 1: 341798; Pricing 1: 1=0.1, 10=0.011, 100=0.0046, 1000=0.00207, 2500=0.0018 (USD); Packaging: Cut Tape (CT); Part Status: Active; Tolerance: ±5%; Composition: Thick Film; Features: Moisture Resistant; Operating Temperature: -55°C ~ 155°C; Package / Case: 0603 (1608 Metric); Supplier Device Package: 0603; Size / Dimension: 0.063" L x 0.032" W (1.60mm x 0.80mm); Height - Seated (Max): 0.022" (0.55mm); Failure Rate: -; ComponentLink1URL: http://www.yageo.com/documents/recent/PYu-RC_Group_51_RoHS_L_7.pdf; ComponentLink1Description: http://www.yageo.com/documents/recent/PYu-RC_Group_51_RoHS_L_7.pdf
U1 = TNY284: IC OFFLINE SWIT OVP OTP HV 8SMD; Manufacturer: Power Integrations; Output Isolation: Isolated; Internal Switch(s): Yes; Voltage - Breakdown: 700V; Topology: Flyback; Duty Cycle: 65%; Frequency - Switching: 132kHz; Fault Protection: Current Limiting, Open Loop, Over Temperature, Over Voltage, Short Circuit; Control Features: EN; Supplier 1: Digi-Key; Supplier Part Number 1: 596-1110-1-ND; Manufacturer Part Number: TNY275GN-TL; RoHS: RoHS Compliant; Category: Integrated Circuits (ICs); Stock 1: 33357; Pricing 1: 1=1.6, 10=1.442, 25=1.2876, 100=1.1588, 250=1.03, 500=0.90126 (USD); Packaging: Cut Tape (CT); Part Status: Active; Voltage - Supply (Vcc/Vdd): -; Operating Temperature: -40°C ~ 150°C (TJ); Package / Case: 8-SMD (7 Leads), Gull Wing; Supplier Device Package: SMD-8C; Mounting Type: Surface Mount; ComponentLink1URL: https://www.power.com/sites/default/files/product-docs/tny274-280.pdf; ComponentLink1Description: https://www.power.com/sites/default/files/product-docs/tny274-280.pdf
U2 = PS250-1: OPTOISOLATOR 3.75KV TRANS 4-SO; Manufacturer: Toshiba Semiconductor and Storage; Number of Channels: 1; Voltage - Isolation: 3750Vrms; Current Transfer Ratio (Min): 100% @ 5mA; Current Transfer Ratio (Max): 600% @ 5mA; Turn On / Turn Off Time (Typ): 3µs, 3µs; Rise / Fall Time (Typ): 2µs, 3µs; Input Type: DC; Output Type: Transistor; Voltage - Output (Max): 80V; Current - Output / Channel: 50mA; Voltage - Forward (Vf) (Typ): 1.25V; Vce Saturation (Max): 300mV; Supplier 1: Digi-Key; Supplier Part Number 1: TLP293(GB-TPLECT-ND; Manufacturer Part Number: TLP293(GB-TPL,E; RoHS: RoHS Compliant; Category: Isolators; Stock 1: 92280; Pricing 1: 1=0.52, 10=0.377, 25=0.308, 100=0.2464, 250=0.20792, 500=0.1771, 1000=0.1386 (USD); Packaging: Cut Tape (CT); Part Status: Active; Current - DC Forward (If) (Max): 50mA; Operating Temperature: -55°C ~ 125°C; Mounting Type: Surface Mount; Package / Case: 4-SOIC (0.179", 4.55mm); Supplier Device Package: 4-SO; ComponentLink1URL: https://toshiba.semicon-storage.com/info/docget.jsp?did=14419&prodName=TLP293; ComponentLink1Description: https://toshiba.semicon-storage.com/info/docget.jsp?did=14419&prodName=TLP293
U3 = TL431: IC VREF SHUNT ADJ SOT23-3; Manufacturer: Texas Instruments; Output Type: Adjustable; Voltage - Output (Min/Fixed): 2.495V; Tolerance: ±1%; Supplier 1: Digi-Key; Supplier Part Number 1: 296-17329-2-ND; Manufacturer Part Number: TL431AIDBZR; RoHS: RoHS Compliant; Category: Integrated Circuits (ICs); Stock 1: 51000; Pricing 1: 3000=0.1155, 6000=0.1085, 15000=0.1015 (USD); Packaging: Tape & Reel (TR); Part Status: Active; Reference Type: Shunt; Temperature Coefficient: -; Noise - 0.1Hz to 10Hz: -; Noise - 10Hz to 10kHz: -; Voltage - Input: -; Current - Supply: -; Operating Temperature: -40°C ~ 85°C (TA); Mounting Type: Surface Mount; Package / Case: TO-236-3, SC-59, SOT-23-3; Supplier Device Package: SOT-23-3; ComponentLink1URL: http://www.ti.com/lit/ds/symlink/tl431a.pdf; ComponentLink1Description: http://www.ti.com/lit/ds/symlink/tl431a.pdf
U4 = MC78PC33NTRG: IC REG LINEAR 3.3V 150MA 5TSOP; Manufacturer: ON Semiconductor; Output Configuration: Positive; Output Type: Fixed; Voltage - Input (Max): 8V; Voltage Dropout (Max): 0.3V @ 100mA; PSRR: 70dB (1kHz); Control Features: Enable; Protection Features: Over Current; Supplier 1: Digi-Key; RoHS: RoHS Compliant; Category: Integrated Circuits (ICs); Stock 1: 8175; Pricing 1: 1=0.78, 10=0.688, 100=0.5274, 500=0.41694, 1000=0.33356 (USD); Packaging: Cut Tape (CT); Part Status: Active; Voltage - Output (Min/Fixed): 3.3V; Voltage - Output (Max): -; Current - Output: 150mA; Operating Temperature: -40°C ~ 85°C; Mounting Type: Surface Mount; Package / Case: SOT-23-5 Thin, TSOT-23-5; Supplier Device Package: 5-TSOP; ComponentLink1URL: http://www.onsemi.com/pub/Collateral/MC78PC00-D.PDF; ComponentLink1Description: http://www.onsemi.com/pub/Collateral/MC78PC00-D.PDF; Supplier Part Number 1: MC78PC33NTRGOSCT-ND; Manufacturer Part Number: MC78PC33NTRG